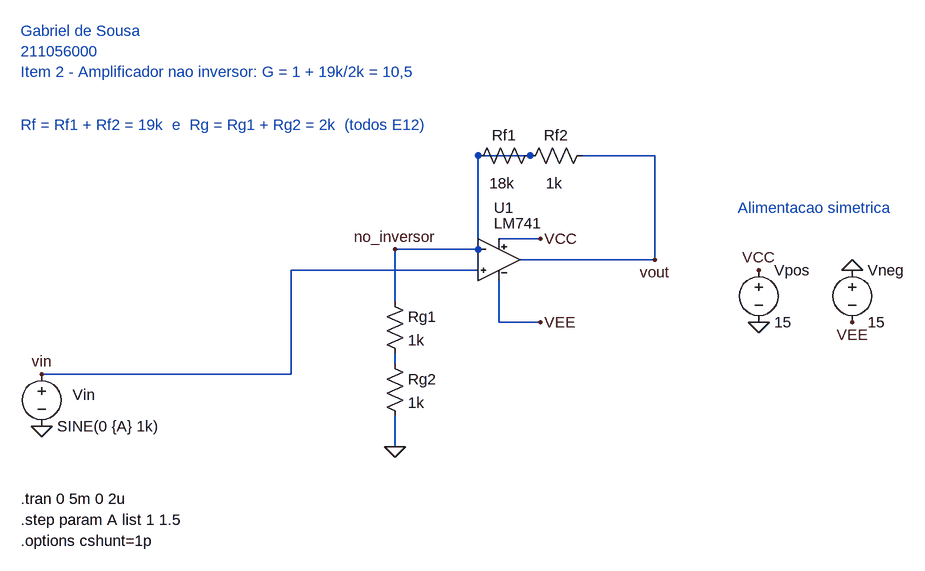
[diagram p0: schematic item_2.asc]
item_2.asc, the LTspice schematic file:
Version 4.1
SHEET 1 1500 820
WIRE 96 480 480 480
WIRE 480 480 480 320
WIRE 480 320 768 320
WIRE 640 288 768 288
WIRE 640 288 640 368
WIRE 640 448 640 464
WIRE 640 544 640 592
WIRE 768 144 768 288
WIRE 768 144 848 144
WIRE 928 144 1040 144
WIRE 1040 144 1040 304
WIRE 1040 304 832 304
WIRE 800 272 864 272
WIRE 800 336 800 400
WIRE 800 400 864 400
FLAG 96 480 vin
FLAG 96 560 0
FLAG 640 288 no_inversor
FLAG 640 592 0
FLAG 864 272 VCC
FLAG 864 400 VEE
FLAG 1040 304 vout
FLAG 1200 320 VCC
FLAG 1200 400 0
FLAG 1344 320 0
FLAG 1344 400 VEE
SYMBOL voltage 96 464 R0
WINDOW 0 48 48 Left 2
SYMATTR InstName Vin
SYMATTR Value SINE(0 {A} 1k)
SYMBOL res 624 352 R0
SYMATTR InstName Rg1
SYMATTR Value 1k
SYMBOL res 624 448 R0
SYMATTR InstName Rg2
SYMATTR Value 1k
SYMBOL res 864 128 R90
WINDOW 0 0 56 VBottom 2
WINDOW 3 58 59 VCenter 2
SYMATTR InstName Rf1
SYMATTR Value 18k
SYMBOL res 944 128 R90
WINDOW 0 0 56 VBottom 2
WINDOW 3 58 59 VCenter 2
SYMATTR InstName Rf2
SYMATTR Value 1k
SYMBOL item_6 800 240 R0
WINDOW 0 -8 -16 Left 2
WINDOW 3 -8 8 Left 2
SYMATTR InstName U1
SYMBOL voltage 1200 304 R0
SYMATTR InstName Vpos
SYMATTR Value 15
SYMBOL voltage 1344 304 R0
SYMATTR InstName Vneg
SYMATTR Value 15
TEXT 64 -48 Left 2 ;Gabriel de Sousa\n211056000\nItem 2 - Amplificador nao inversor: G = 1 + 19k/2k = 10,5
TEXT 64 96 Left 2 ;Rf = Rf1 + Rf2 = 19k  e  Rg = Rg1 + Rg2 = 2k  (todos E12)
TEXT 1168 224 Left 2 ;Alimentacao simetrica
TEXT 64 672 Left 2 !.tran 0 5m 0 2u
TEXT 64 704 Left 2 !.step param A list 1 1.5
TEXT 64 736 Left 2 !.options cshunt=1p

The netlist it stands for:
* item_2.asc
Vin vin 0 SINE(0 {A} 1k)
Rg1 no_inversor N001 1k
Rg2 N001 0 1k
Rf1 no_inversor no_inversor 18k
Rf2 vout no_inversor 1k
X§U1 vin no_inversor VCC VEE vout LM741  ; pins In+ In- V+ V- OUT
Vpos VCC 0 15
Vneg 0 VEE 15
* Gabriel de Sousa
* 211056000
* Item 2 - Amplificador nao inversor: G = 1 + 19k/2k = 10,5
* Rf = Rf1 + Rf2 = 19k  e  Rg = Rg1 + Rg2 = 2k  (todos E12)
* Alimentacao simetrica
.tran 0 5m 0 2u
.step param A list 1 1.5
.options cshunt=1p
.lib ene0046.lib
.backanno
.end